# Altium schematic sheet IMU.SchDoc
size A4; SheetNumber: 4; SheetTotal: 8
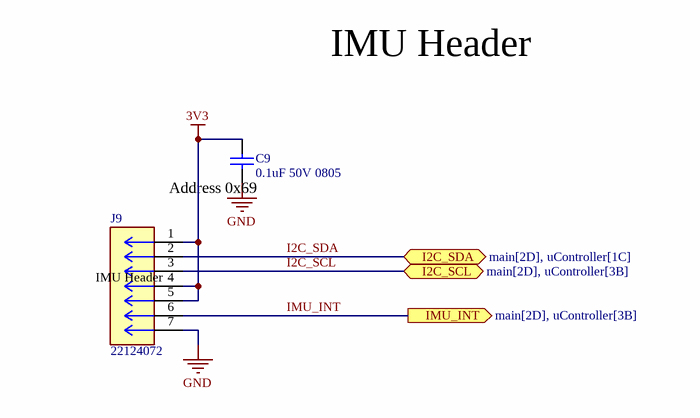
[diagram p0: IMU.SchDoc]

## Parts
C9  0.1uF 50V 0805  [CAPC2012X14N]
J9  22124072  [CONN_A-7395-07B_MOL]

## Ports
I2C_SCL (bidir, see main[2D], uController[3B]), I2C_SDA (bidir, see main[2D], uController[1C]), IMU_INT (out, see main[2D], uController[3B])

## Nets
3V3: C9.2 J9.1 J9.4 J9.5
GND: C9.1 J9.7
I2C_SCL: J9.3 ; port I2C_SCL
I2C_SDA: J9.2 ; port I2C_SDA
IMU_INT: J9.6 ; port IMU_INT

## Notes on the sheet
- IMU Header
- (near J9) Address 0x69

## Library data of the parts
C9 = CMP-40-005-00117-1: Cap, SMD, 0.1uF, 50V, 10%, 0805, X7R; Manufacturer: Samsung; ManufacturerPartNumber: CL21B104KBCWPNC; CapacitorType: Ceramic; Value: 100nF; ComponentLinkDescription: Datasheet; Package: 0805; MountingType: SMD; VoltageRating: 50V; Tolerance: 10%; ComponentLinkURL: https://octopart.com/part/samsung-electro-mechanics/CL21B104KBCWPNC; DielectricType: Ceramic
J9 = 22124072: Package: None; Price: None; Value: *; MP: 22124072; Availability: Unavailable